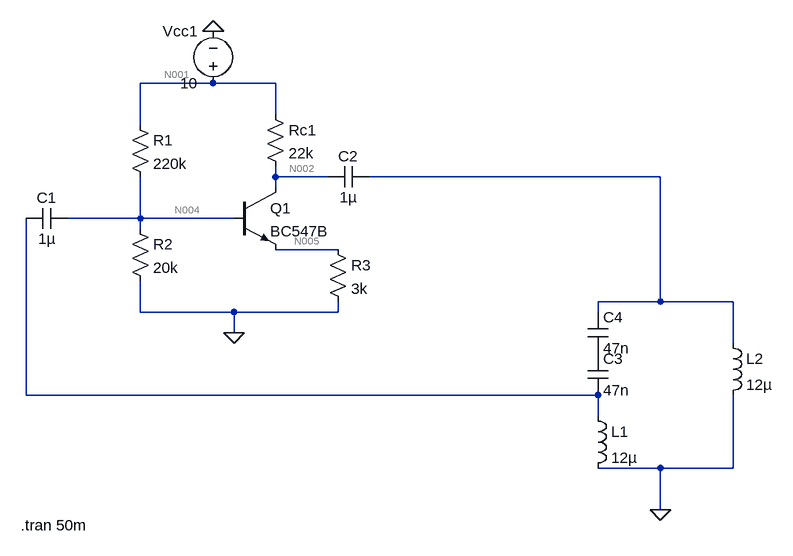
[diagram p0: schematic tank_amplifier_combined.asc]
tank_amplifier_combined.asc, the LTspice schematic file:
Version 4
SHEET 1 1092 680
WIRE 144 -48 32 -48
WIRE 240 -48 144 -48
WIRE 240 0 240 -48
WIRE 32 16 32 -48
WIRE 240 96 240 80
WIRE 320 96 240 96
WIRE 832 96 384 96
WIRE 240 112 240 96
WIRE 32 160 32 96
WIRE 32 160 -80 160
WIRE 176 160 32 160
WIRE 32 176 32 160
WIRE 336 208 240 208
WIRE 832 288 832 96
WIRE 832 288 736 288
WIRE 944 288 832 288
WIRE 32 304 32 256
WIRE 176 304 32 304
WIRE 336 304 336 288
WIRE 336 304 176 304
WIRE 736 304 736 288
WIRE 176 336 176 304
WIRE 944 352 944 288
WIRE -144 432 -144 160
WIRE 736 432 -144 432
WIRE 736 464 736 432
WIRE 832 544 736 544
WIRE 944 544 944 432
WIRE 944 544 832 544
WIRE 832 608 832 544
FLAG 832 608 0
FLAG 176 336 0
FLAG 144 -128 0
SYMBOL ind 720 448 R0
SYMATTR InstName L1
SYMATTR Value 12µ
SYMBOL ind 928 336 R0
SYMATTR InstName L2
SYMATTR Value 12µ
SYMBOL voltage 144 -32 R180
WINDOW 0 24 96 Left 2
WINDOW 3 24 16 Left 2
WINDOW 123 0 0 Left 0
WINDOW 39 0 0 Left 0
SYMATTR InstName Vcc1
SYMATTR Value 10
SYMBOL res 16 0 R0
SYMATTR InstName R1
SYMATTR Value 220k
SYMBOL res 224 -16 R0
SYMATTR InstName Rc1
SYMATTR Value 22k
SYMBOL res 16 160 R0
SYMATTR InstName R2
SYMATTR Value 20k
SYMBOL npn 176 112 R0
SYMATTR InstName Q1
SYMATTR Value BC547B
SYMBOL cap -80 144 R90
WINDOW 0 0 32 VBottom 2
WINDOW 3 32 32 VTop 2
SYMATTR InstName C1
SYMATTR Value 1µ
SYMBOL cap 384 80 R90
WINDOW 0 0 32 VBottom 2
WINDOW 3 32 32 VTop 2
SYMATTR InstName C2
SYMATTR Value 1µ
SYMBOL res 320 192 R0
SYMATTR InstName R3
SYMATTR Value 3k
SYMBOL cap 720 368 R0
SYMATTR InstName C3
SYMATTR Value 47n
SYMBOL cap 720 304 R0
SYMATTR InstName C4
SYMATTR Value 47n
TEXT -152 632 Left 2 !.tran 50m

The netlist it stands for:
* tank_amplifier_combined.asc
L1 N006 0 12µ
L2 N003 0 12µ
Vcc1 N001 0 10
R1 N001 N004 220k
Rc1 N001 N002 22k
R2 N004 0 20k
Q1 N002 N004 N005 0 BC547B
C1 N004 N006 1µ
C2 N003 N002 1µ
R3 N005 0 3k
C3 P001 N006 47n
C4 N003 P001 47n
.model NPN NPN
.model PNP PNP
.lib standard.bjt
.tran 50m
.backanno
.end

* Results of the author's LTspice run, read from the files saved beside the schematic
* Operating Point, zero values left out:
*   V(n001) = 10 V
*   V(n004) = 828.4 mV
*   V(n002) = 8.12 V
*   V(n005) = 257.1 mV
*   Ic(Q1) = 85.43 µA
*   Ib(Q1) = 271.6 nA
*   Ie(Q1) = -85.71 µA
*   I(R1) = 41.69 µA
*   I(Rc1) = 85.43 µA
*   I(R2) = 41.42 µA
*   I(R3) = 85.71 µA
*   I(Vcc1) = -127.1 µA